# EAGLE design esp-06 breakout (EAGLE 7.5.0)
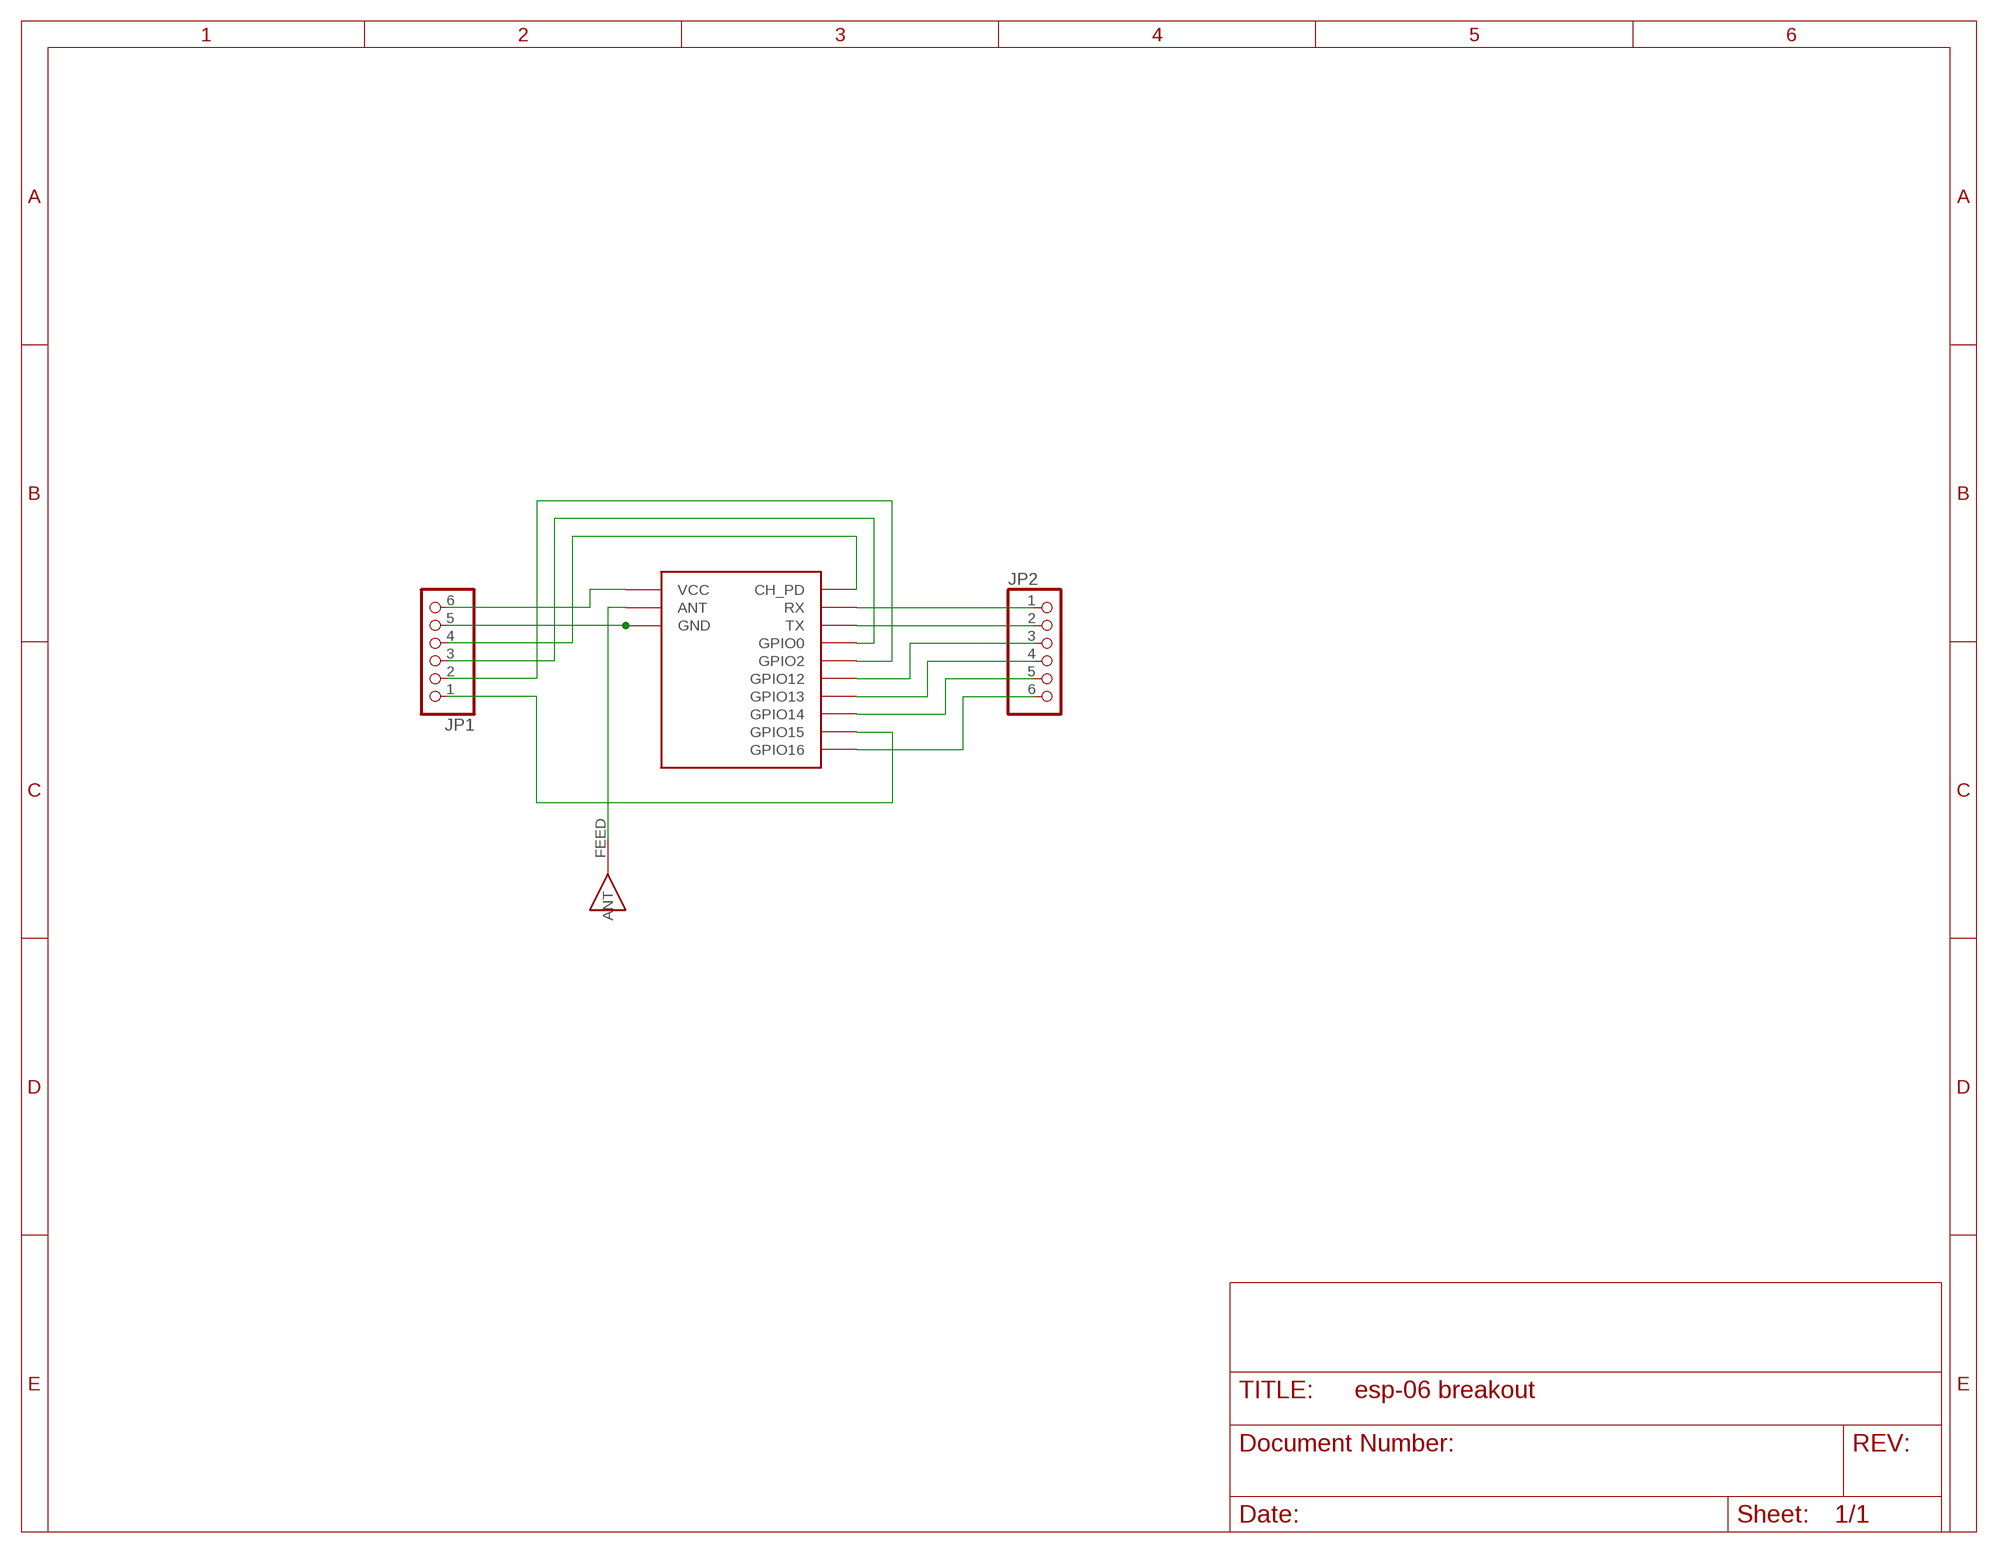
[diagram p0: schematic, sheet 1]

## Parts
JP1  PINHD-1X6  [1X06]
JP2  PINHD-1X6  [1X06]
U$1  ESP06  [ESP06]
U$2  ANT  [ANTENNA-CERAMIC]

## Nets
N$1: JP1.6 U$1.VCC
N$2: JP1.5 U$1.GND U$1.GND1(GND2) U$1.GND2(GND3) U$1.GND3(GND4) U$1.GND4(GND5) U$1.GND5(GND6) U$1.GND6(GND7) U$1.GND7(GND8)
N$3: JP1.4 U$1.CH_PD
N$4: JP2.1 U$1.RX
N$5: JP2.2 U$1.TX
N$6: JP1.3 U$1.GPIO0
N$7: JP1.2 U$1.GPIO2
N$8: JP2.3 U$1.GPIO12
N$9: JP2.4 U$1.GPIO13
N$10: JP2.5 U$1.GPIO14
N$11: JP1.1 U$1.GPIO15
N$12: JP2.6 U$1.GPIO16
N$14: U$1.ANT U$2.FEED(ANT)

## Library data of the parts
JP1 JP2 = pinhead:PINHD-1X6: PIN HEADER
U$1 = esp8266modules:ESP06: ESP8266 Wifi module 06
U$2 = rainsun-ant:ANT

## Board
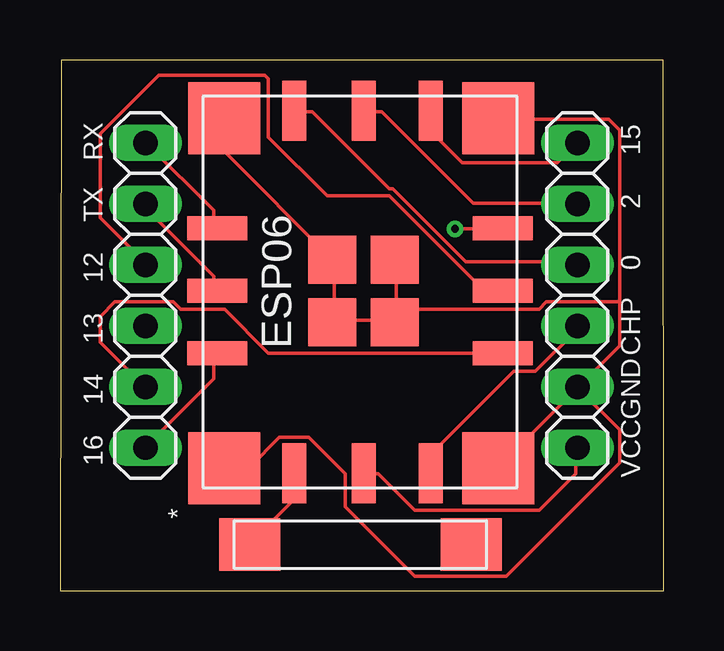
[diagram p1: board, top side]
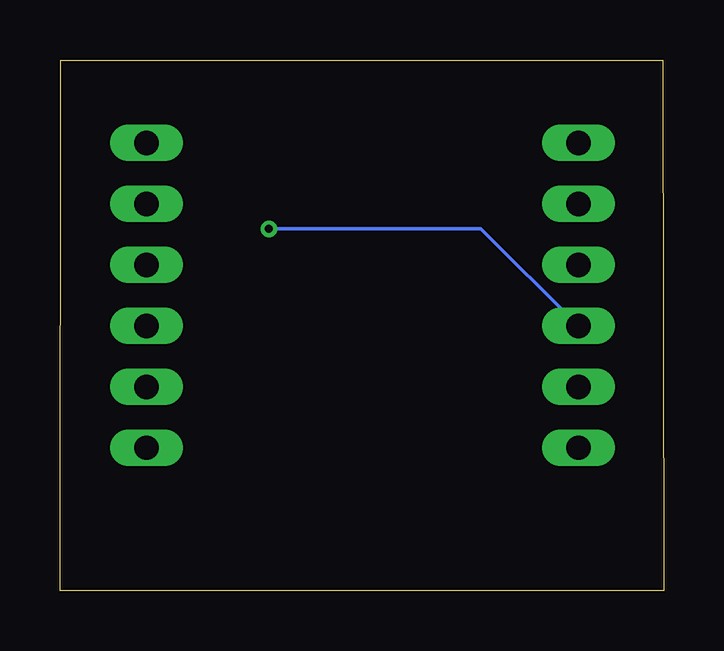
[diagram p2: board, bottom side, seen from below]

Size 25.16 x 22.12 mm. Coordinates in mm from the lower left corner, seen from the top.
Outline: 0,0 25.16,0 25.13,22.12 0.05,22.12 0,0
Copper layers (1*16): Top 0.0356mm / dielectric 1.5011mm / Bottom 0.0356mm
Design rules "oshpark-2layer": minimum track width 6mil, minimum drill 13mil, track to track 6mil, track to pad 6mil, pad to pad 6mil, via to via 6mil, smd to smd 6mil, copper to edge 15mil, drill to drill 6mil, minimum pad ring 7mil, minimum via ring 7mil, stop-mask expansion 2.5mil, vias tented up to drill 0mil, thermal gap 10mil

### Footprints (pad centres in the part's own frame; a part is rotated, then mirrored left to right if it is on the bottom)
1X06 = drill 1.016 long: 1 -6.35,0; 2 -3.81,0; 3 -1.27,0; 4 1.27,0; 5 3.81,0; 6 6.35,0
ESP06 = smd 2.5 x 1: ANT -7.4,3.3; CH_PD -7.4,-2.4; GPIO0 7.7,3.3; GPIO2 7.7,0.4; GPIO15 7.7,-2.4; VCC -7.4,0.4 | smd 3 x 3: GND -7.2,6.2; GND1 -7.2,-5.2; GND2 7.4,-5.2; GND3 7.4,6.2 | smd 2 x 2: GND4 -1.1,1.7; GND5 1.5,1.7; GND6 1.5,-0.9; GND7 -1.1,-0.9 | smd 1 x 2.5: GPIO12 0.2,-5.4; GPIO13 2.8,-5.4; GPIO14 -2.4,-5.4; GPIO16 -2.4,6.5; RX 2.8,6.5; TX 0.2,6.5
ANTENNA-CERAMIC = smd 2.54 x 2.184: FEED 4.865,0; NC -4.365,0

### Placement (x,y rotation side)
JP1  21.56,12.31 270 top
JP2  3.56,12.31 270 top
U$1  13.05,12.3 90 top
U$2  12.77,1.93 180 top

### Tracks (layer width: path | path; a pad name or v marks a point on that pad's centre or on a via)
N$1
  Top 0.152: U$1.VCC 12.8,4.88 13.26,4.88 14.78,3.35 19.96,3.35 21.49,4.88 21.49,5.94 JP1.6
N$2
  Top 0.152: 11.43,11.28 11.43,13.72 U$1.GND5 11.28,13.87 6.86,18.29 6.86,19.66 U$1.GND3 | 14.02,11.73 14.02,13.72 U$1.GND6 | 14.02,11.73 14.02,11.28 U$1.GND7 | 11.43,11.28 13.87,11.28 U$1.GND7 | 11.43,11.28 U$1.GND4 | U$1.GND 6.86,5.18 7.92,5.18 9.14,6.4 10.36,6.4 11.89,4.88 11.89,3.5 14.78,0.61 18.59,0.61 23.32,5.33 23.32,6.71 21.64,8.38 JP1.5 | U$1.GND1 18.29,5.18 21.49,8.38 JP1.5 | 23.32,12.04 23.32,10.21 21.64,8.53 JP1.5 | 23.32,12.04 23.32,19.2 22.86,19.66 18.29,19.66 U$1.GND2 | 14.02,11.73 19.96,11.73 20.27,12.04 23.32,12.04 | 14.02,11.73 U$1.GND7
N$3
  Top 0.152: U$1.CH_PD 15.54,5.03 15.54,5.79 18.9,9.14 19.81,9.14 21.64,10.97 JP1.4
N$4
  Top 0.152: U$1.RX 6.4,15.24 6.4,15.85 3.66,18.59 JP2.1
N$5
  Top 0.152: U$1.TX 6.4,12.65 6.4,13.11 3.5,16 JP2.2
N$6
  Top 0.152: U$1.GPIO0 9.75,19.96 10.52,19.96 13.72,16.76 13.87,16.76 16.92,13.72 21.49,13.72 JP1.3
N$7
  Top 0.152: U$1.GPIO2 12.8,19.96 13.41,19.96 17.22,16.15 21.49,16.15 JP1.2
N$8
  Top 0.152: U$1.GPIO12 18.44,12.65 17.53,12.65 13.72,16.46 11.12,16.46 8.69,18.9 8.69,21.34 8.53,21.49 4.12,21.49 1.68,19.05 1.68,15.54 3.5,13.72 JP2.3
N$9  (via drill 0.33)
  Top 0.152: v16.46,15.09 18.44,15.09 U$1.GPIO13
  Bottom 0.152: v16.46,15.09 7.62,15.09 3.66,11.12 JP2.4
N$10
  Top 0.152: U$1.GPIO14 8.69,9.91 6.86,11.73 5.03,11.73 4.72,12.04 2.29,12.04 1.68,11.43 1.68,10.36 3.5,8.53 JP2.5
N$11
  Top 0.152: U$1.GPIO15 15.54,19.96 15.54,19.05 16.76,17.83 20.73,17.83 21.49,18.59 JP1.1
N$12
  Top 0.152: U$1.GPIO16 6.4,9.75 6.4,8.84 3.66,6.1 JP2.6
N$14
  Top 0.152: U$1.ANT 9.6,4.88 9.6,3.66 7.92,1.98 U$2.FEED

### Text on the board
tPlace: 15 | RX | 2 | TX | 0 | 12 | CHP | 13 | GND | 14 | VCC | 16 | *